# EAGLE design motoresT2 (EAGLE 9.6.2)
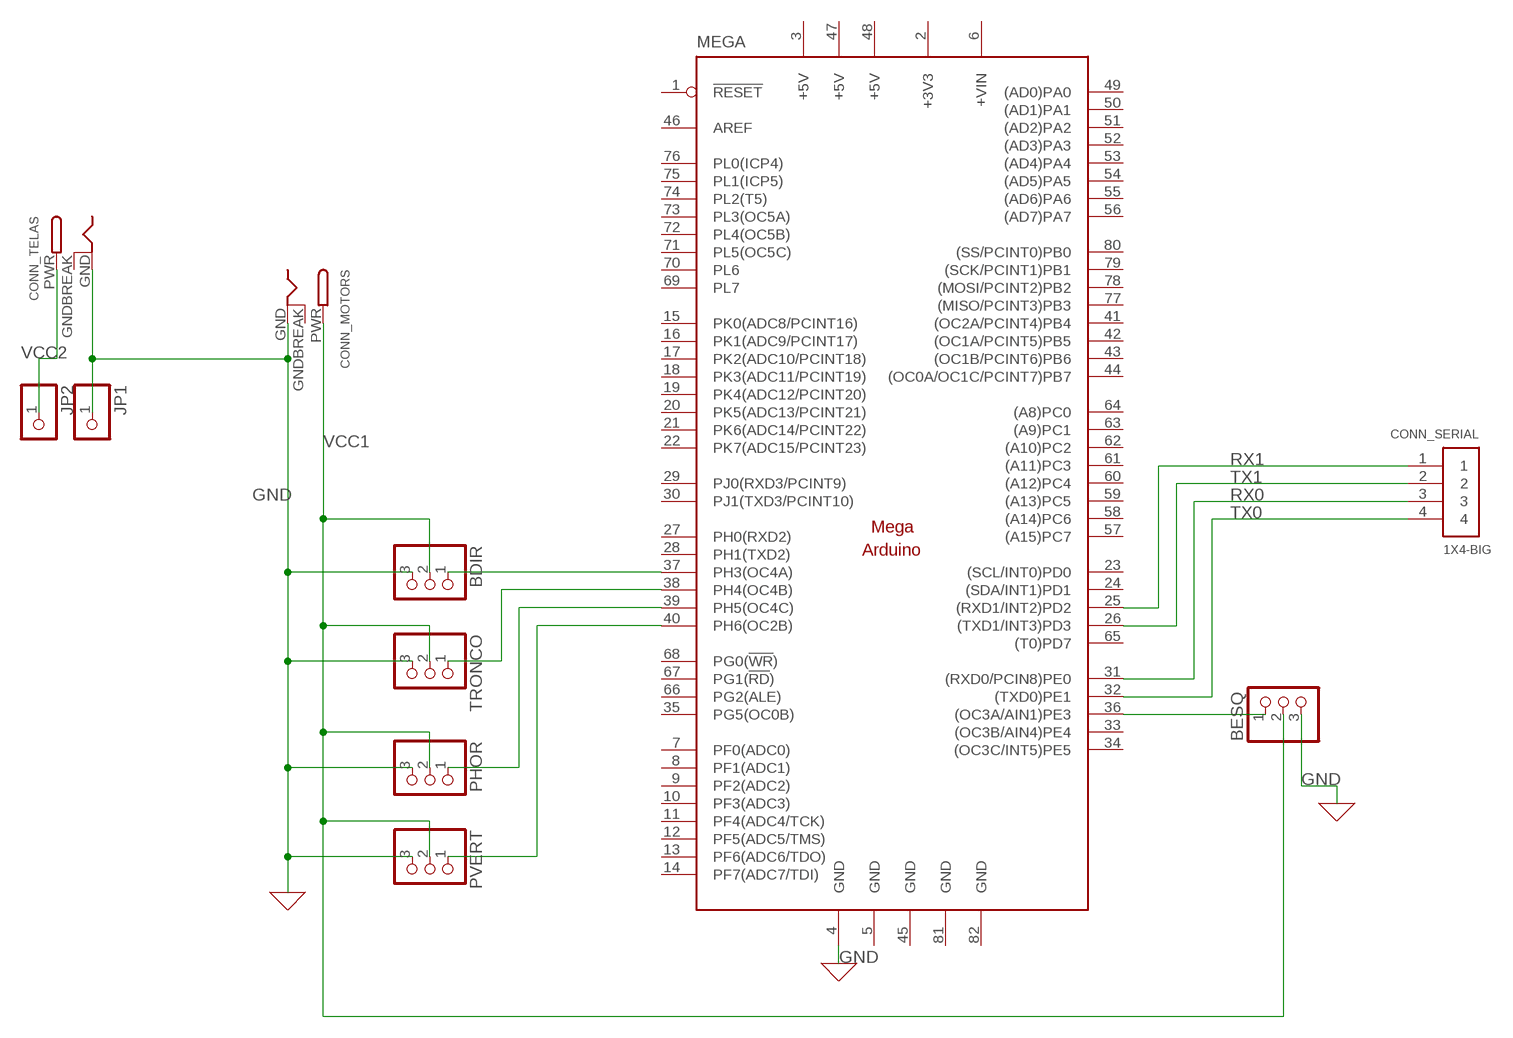
[diagram p0: schematic, sheet 1]

## Parts
BDIR  PINHD-1X3  [1X03]
BESQ  PINHD-1X3  [1X03]
CONN_MOTORS  DCBARRELPTH  [DCJACK_2MM_PTH]
CONN_SERIAL  1X4-BIG  [1X04-BIG]
CONN_TELAS  DCBARRELPTH  [DCJACK_2MM_PTH]
JP1  PINHD-1X1  [1X01]
JP2  PINHD-1X1  [1X01]
MEGA  MEGAARDUINO_11  [MEGA_ARDUINO_1]
PHOR  PINHD-1X3  [1X03]
PVERT  PINHD-1X3  [1X03]
TRONCO  PINHD-1X3  [1X03]

## Nets
GND: BDIR.3 BESQ.3 CONN_MOTORS.GND CONN_TELAS.GND JP1.1 MEGA.4(GND) PHOR.3 PVERT.3 TRONCO.3
N$1: BDIR.1 MEGA.37(PH3(OC4A))
N$2: MEGA.38(PH4(OC4B)) TRONCO.1
N$4: MEGA.39(PH5(OC4C)) PHOR.1
N$5: MEGA.40(PH6(OC2B)) PVERT.1
N$6: BESQ.1 MEGA.36((OC3A/AIN1)PE3)
RX0: CONN_SERIAL.3 MEGA.31((RXD0/PCIN8)PE0)
RX1: CONN_SERIAL.1 MEGA.25((RXD1/INT2)PD2)
TX0: CONN_SERIAL.4 MEGA.32((TXD0)PE1)
TX1: CONN_SERIAL.2 MEGA.26((TXD1/INT3)PD3)
VCC1 [corrente]: BDIR.2 BESQ.2 CONN_MOTORS.PWR PHOR.2 PVERT.2 TRONCO.2
VCC2 [corrente]: CONN_TELAS.PWR JP2.1
Unconnected: MEGA.1(!RESET) MEGA.7(PF0(ADC0)) MEGA.8(PF1(ADC1)) MEGA.9(PF2(ADC2)) MEGA.10(PF3(ADC3)) MEGA.11(PF4(ADC4/TCK)) MEGA.12(PF5(ADC5/TMS)) MEGA.13(PF6(ADC6/TDO)) MEGA.14(PF7(ADC7/TDI)) MEGA.15(PK0(ADC8/PCINT16)) MEGA.16(PK1(ADC9/PCINT17)) MEGA.17(PK2(ADC10/PCINT18)) MEGA.18(PK3(ADC11/PCINT19)) MEGA.19(PK4(ADC12/PCINT20)) MEGA.20(PK5(ADC13/PCINT21)) MEGA.21(PK6(ADC14/PCINT22)) MEGA.22(PK7(ADC15/PCINT23)) MEGA.23((SCL/INT0)PD0) MEGA.24((SDA/INT1)PD1) MEGA.27(PH0(RXD2)) MEGA.28(PH1(TXD2)) MEGA.29(PJ0(RXD3/PCINT9)) MEGA.30(PJ1(TXD3/PCINT10)) MEGA.33((OC3B/AIN4)PE4) MEGA.34((OC3C/INT5)PE5) MEGA.35(PG5(OC0B)) MEGA.41((OC2A/PCINT4)PB4) MEGA.42((OC1A/PCINT5)PB5) MEGA.43((OC1B/PCINT6)PB6) MEGA.44((OC0A/OC1C/PCINT7)PB7) MEGA.46(AREF) MEGA.49((AD0)PA0) MEGA.50((AD1)PA1) MEGA.51((AD2)PA2) MEGA.52((AD3)PA3) MEGA.53((AD4)PA4) MEGA.54((AD5)PA5) MEGA.55((AD6)PA6) MEGA.56((AD7)PA7) MEGA.57((A15)PC7) MEGA.58((A14)PC6) MEGA.59((A13)PC5) MEGA.60((A12)PC4) MEGA.61((A11)PC3) MEGA.62((A10)PC2) MEGA.63((A9)PC1) MEGA.64((A8)PC0) MEGA.65((T0)PD7) MEGA.66(PG2(ALE)) MEGA.67(PG1(!RD!)) MEGA.68(PG0(!WR!)) MEGA.69(PL7) MEGA.70(PL6) MEGA.71(PL5(OC5C)) MEGA.72(PL4(OC5B)) MEGA.73(PL3(OC5A)) MEGA.74(PL2(T5)) MEGA.75(PL1(ICP5)) MEGA.76(PL0(ICP4)) MEGA.77((MISO/PCINT3)PB3) MEGA.78((MOSI/PCINT2)PB2) MEGA.79((SCK/PCINT1)PB1) MEGA.80((SS/PCINT0)PB0)

## Power pins joined to a net without a drawn wire
+3V3: MEGA.2(+3V3)
+5V: MEGA.3(+5V) MEGA.47(+5V) MEGA.48(+5V)
+VIN: MEGA.6(+VIN)
GND: MEGA.5(GND) MEGA.45(GND) MEGA.81(GND) MEGA.82(GND)
GNDBREAK: CONN_MOTORS.GNDBREAK CONN_TELAS.GNDBREAK

## Library data of the parts
BDIR BESQ PHOR PVERT TRONCO = adafruit:PINHD-1X3: PIN HEADER
CONN_MOTORS CONN_TELAS = adafruit:DCBARREL: 2.0mm DC Barrel Jack DCJACK_2MM_PTH - Through Hole Jack (4UConnector: 05537)
CONN_SERIAL = adafruit:1X4: 4-pin connector
JP1 JP2 = adafruit:PINHD-1X1: Pin header 1x1 for 0.1" spacing With round pins
MEGA = arduino:MEGAARDUINO_1: The Arduino Mega is a microcontroller board based on the ATmega1280. - 54 digital input/output pins (of which 14 can be used as PWM outputs) - 16 analog inputs - 4 UARTs (hardware serial ports) - 16 MHz crystal oscillator - USB connection - power jack - ICSP header - reset button It contains everything needed to support the microcontroller; simply connect it to a computer with a USB cable or power it with a AC-to-DC adapter or battery to get started. The Mega is compatible with most shields designed for the Arduino Duemilanove or Diecimila. http://arduino.cc/en/Main/ArduinoBoardMega

## Net classes
0 default: width 0.508 mm, clearance 0.5 mm
1 corrente: width 1.016 mm, clearance 0.5 mm

## Board
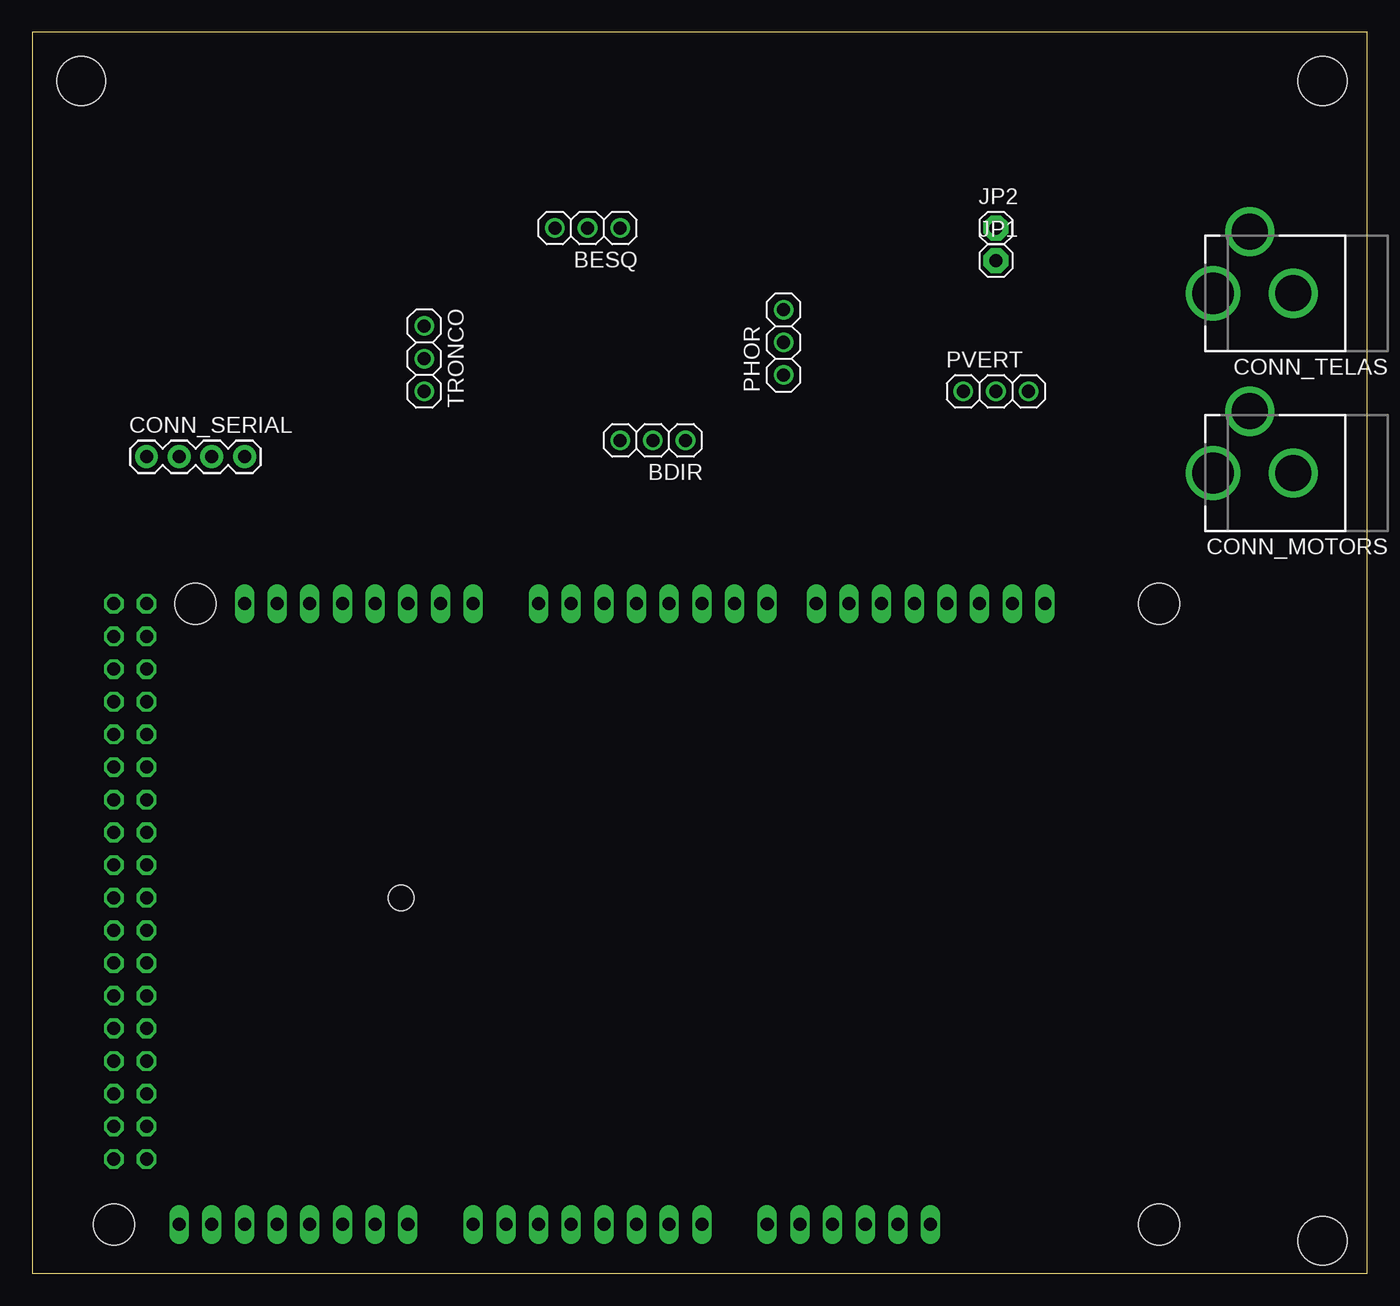
[diagram p1: board, top side]
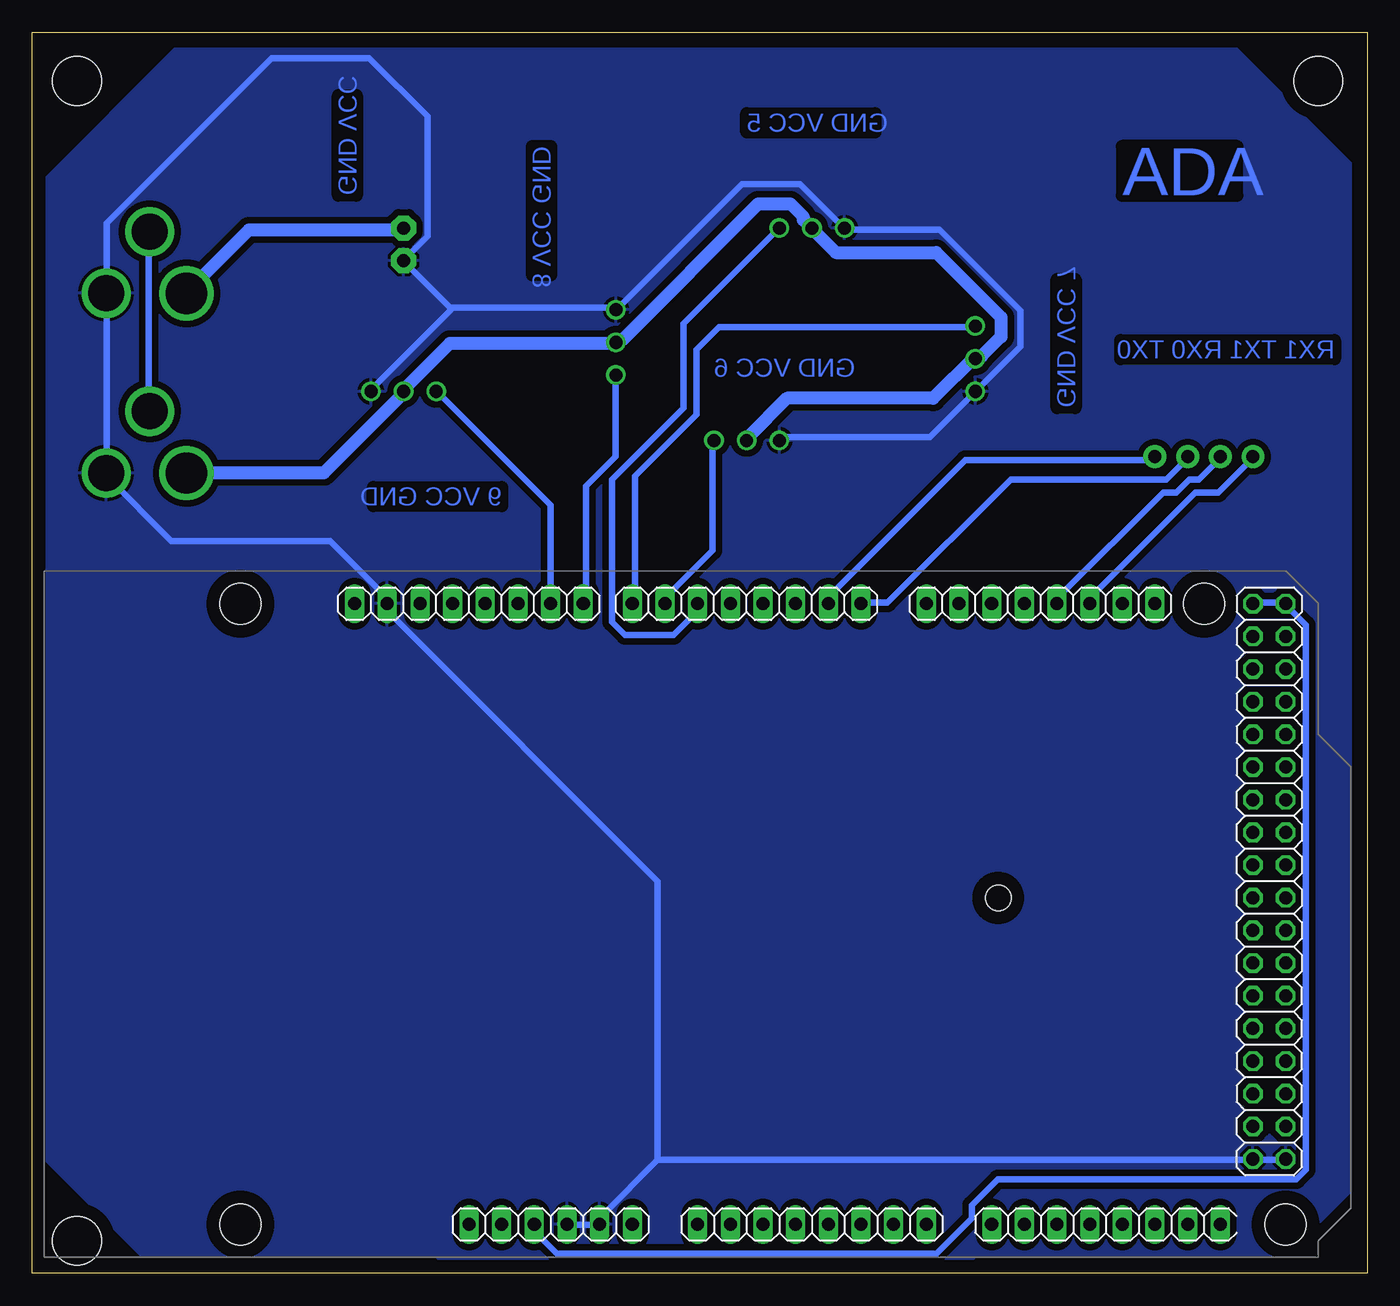
[diagram p2: board, bottom side, seen from below]

Size 103.81 x 96.51 mm. Coordinates in mm from the lower left corner, seen from the top.
Outline: 0,0 103.81,0 103.81,96.51 0,96.51 0,0
Copper layers (1*16): Top 0.035mm / dielectric 1.5mm / Bottom 0.035mm
Design rules "default": minimum track width 6mil, minimum drill 0.35mm, track to track 6mil, track to pad 6mil, pad to pad 6mil, via to via 6mil, smd to smd 6mil, copper to edge 40mil, drill to drill 6mil, minimum pad ring 10mil, minimum via ring 8mil, stop-mask expansion 4mil, vias tented up to drill 0mil, thermal gap 10mil
Holes 3.81 mm at 3.81,92.71 100.33,92.71 100.33,2.54

### Footprints (pad centres in the part's own frame; a part is rotated, then mirrored left to right if it is on the bottom)
1X03 = drill 1.016: 1 -2.54,0; 2 0,0; 3 2.54,0
DCJACK_2MM_PTH = drill 2.8: GND 0,7.35; GNDBREAK 4.8,10.75 | drill 3.2: PWR 0,13.6
1X04-BIG = drill 1.016 pad 1.778: 1 0,0; 2 2.54,0; 3 5.08,0; 4 7.62,0
1X01 = drill 1.016 pad 1.93 octagon: 1 0,0
MEGA_ARDUINO_1 = drill 1.016 long: 1 33.02,2.54; 2 35.56,2.54; 3 38.1,2.54; 4 40.64,2.54; 5 43.18,2.54; 6 45.72,2.54; 7 50.8,2.54; 8 53.34,2.54; 9 55.88,2.54; 10 58.42,2.54; 11 60.96,2.54; 12 63.5,2.54; 13 66.04,2.54; 14 68.58,2.54; 15 73.66,2.54; 16 76.2,2.54; 17 78.74,2.54; 18 81.28,2.54; 19 83.82,2.54; 20 86.36,2.54; 21 88.9,2.54; 22 91.44,2.54; 23 86.36,50.8; 24 83.82,50.8; 25 81.28,50.8; 26 78.74,50.8; 27 76.2,50.8; 28 73.66,50.8; 29 71.12,50.8; 30 68.58,50.8; 31 63.5,50.8; 32 60.96,50.8; 33 58.42,50.8; 34 55.88,50.8; 35 53.34,50.8; 36 50.8,50.8; 37 48.26,50.8; 38 45.72,50.8; 39 41.91,50.8; 40 39.37,50.8; 41 36.83,50.8; 42 34.29,50.8; 43 31.75,50.8; 44 29.21,50.8; 45 26.67,50.8; 46 24.13,50.8 | drill 1.016 octagon: 47 93.98,50.8; 48 96.52,50.8; 49 93.98,48.26; 50 96.52,48.26; 51 93.98,45.72; 52 96.52,45.72; 53 93.98,43.18; 54 96.52,43.18; 55 93.98,40.64; 56 96.52,40.64; 57 93.98,38.1; 58 96.52,38.1; 59 93.98,35.56; 60 96.52,35.56; 61 93.98,33.02; 62 96.52,33.02; 63 93.98,30.48; 64 96.52,30.48; 65 93.98,27.94; 66 96.52,27.94; 67 93.98,25.4; 68 96.52,25.4; 69 93.98,22.86; 70 96.52,22.86; 71 93.98,20.32; 72 96.52,20.32; 73 93.98,17.78; 74 96.52,17.78; 75 93.98,15.24; 76 96.52,15.24; 77 93.98,12.7; 78 96.52,12.7; 79 93.98,10.16; 80 96.52,10.16; 81 93.98,7.62; 82 96.52,7.62 | hole 3.2: 15.24,50.8; 15.24,2.54; 90.17,50.8; 96.52,2.54 | hole 2: 74.168,27.94

### Placement (x,y rotation side)
BDIR  48.26,64.77 180 top
BESQ  43.18,81.28 180 top
CONN_MOTORS  105.41,62.23 90 top
CONN_SERIAL  8.89,63.5 0 top
CONN_TELAS  105.41,76.2 90 top
JP1  74.93,78.74 0 top
JP2  74.93,81.28 0 top
MEGA  102.87,1.27 0 bottom
PHOR  58.42,72.39 90 top
PVERT  74.93,68.58 0 top
TRONCO  30.48,71.12 270 top

### Tracks (layer width: path | path; a pad name or v marks a point on that pad's centre or on a via)
+5V
  Bottom 0.508: MEGA.47 8.82,52.16 6.55,52.16 MEGA.48 6.3,51.91 4.79,50.4 4.79,8.06 5.54,7.31 28.73,7.31 30.74,5.29 30.74,4.28 33.52,1.51 63,1.51 64.76,3.28 64.76,3.78 MEGA.3
GND
  Bottom 0.508: MEGA.4 61.99,3.78 59.72,3.78 MEGA.5 59.47,4.03 59.47,4.54 55.19,8.82 | MEGA.82 6.55,8.82 8.82,8.82 MEGA.81 9.07,8.82 55.19,8.82 | BDIR.3 45.61,65.02 34.02,65.02 30.49,68.54 TRONCO.3 30.24,68.8 26.96,72.07 26.96,74.84 33.26,81.14 40.57,81.14 BESQ.3 40.82,81.4 44.1,84.67 48.64,84.67 58.21,75.1 PHOR.3 58.46,75.1 71.32,75.1 | 71.32,75.1 74.84,78.62 JP1.1 74.84,78.88 73.08,80.64 73.08,89.96 77.62,94.5 85.18,94.5 98.03,81.65 98.03,76.36 CONN_TELAS.GND 98.03,76.1 98.03,62.24 CONN_MOTORS.GND 98.03,61.99 92.99,56.95 80.64,56.95 76.36,52.67 76.36,52.16 MEGA.45 76.1,51.91 76.1,51.41 55.19,30.49 55.19,8.82 | PVERT.3 77.36,68.8 71.32,74.84 71.32,75.1
  pour Bottom: 8.89,1.27 30.48,1.27 31.75,0 69.85,0 71.12,0 72.39,1.27 95.25,1.27 102.87,8.89 102.87,85.09 92.71,95.25 10.16,95.25 1.27,86.36 1.27,6.35 6.35,1.27
GNDBREAK
  Bottom 0.508: CONN_MOTORS.GNDBREAK 94.75,67.03 94.75,80.89 CONN_TELAS.GNDBREAK
N$1
  Bottom 0.508: BDIR.1 50.9,64.76 50.9,56.2 54.43,52.67 54.43,52.16 MEGA.37
N$2
  Bottom 0.508: MEGA.38 56.95,52.16 56.95,61.99 52.16,66.78 52.16,71.82 50.4,73.58 30.49,73.58 TRONCO.1
N$4
  Bottom 0.508: PHOR.1 58.46,69.8 58.46,63.5 60.73,61.24 60.73,52.16 MEGA.39
N$5
  Bottom 0.508: MEGA.40 63.5,52.16 63.5,59.72 72.32,68.54 PVERT.1
N$6
  Bottom 0.508: MEGA.36 52.16,51.91 52.16,51.41 53.93,49.64 57.71,49.64 58.72,50.65 58.72,61.74 53.17,67.28 53.17,73.84 45.86,81.14 BESQ.1
RX0
  Bottom 0.508: MEGA.31 39.31,52.16 37.3,52.16 27.72,61.74 15.62,61.74 14.11,63.25 CONN_SERIAL.3
RX1
  Bottom 0.508: MEGA.25 21.42,52.16 21.42,52.67 13.36,60.73 11.59,60.73 9.07,63.25 CONN_SERIAL.1
TX0
  Bottom 0.508: MEGA.32 41.83,52.16 41.83,52.67 31.25,63.25 16.63,63.25 CONN_SERIAL.4
TX1
  Bottom 0.508: MEGA.26 23.94,52.16 23.94,52.67 15.88,60.73 14.87,60.73 13.86,61.74 13.1,61.74 11.59,63.25 CONN_SERIAL.2
VCC1
  Bottom 1.016: BDIR.2 48.13,65.02 45.11,68.04 33.77,68.04 30.49,71.32 TRONCO.2 29.99,71.32 28.48,72.83 28.48,74.34 33.52,79.38 41.33,79.38 42.84,80.89 BESQ.2 43.34,81.4 43.85,81.9 43.85,82.15 44.86,83.16 47.38,83.16 57.96,72.58 PHOR.2 58.46,72.32 71.32,72.32 74.84,68.8 PVERT.2 75.1,68.29 81.14,62.24 91.73,62.24 CONN_MOTORS.PWR
VCC2
  Bottom 1.016: JP2.1 75.1,81.14 86.94,81.14 91.73,76.36 CONN_TELAS.PWR

### Text on the board
Bottom: GND VCC 5 | 8 VCC GND | ADA | GND VCC | RX1 TX1 RX0 TX0 | GND VCC 6 | GND VCC 7 | 9 VCC GND